# EAGLE design Desklamp V322 (EAGLE 6.4)
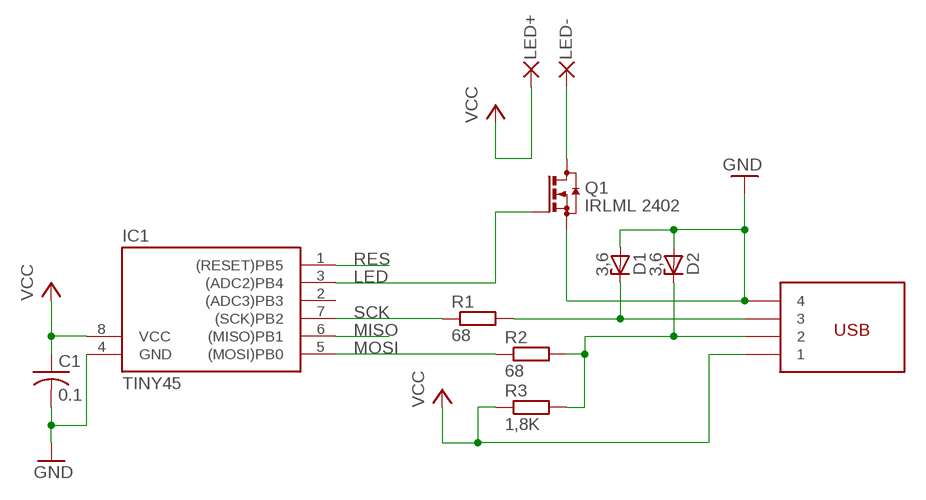
[diagram p0: schematic, sheet 1]

## Parts
C1  0.1  C-USC0805  [C0805]
D1  3,6  ZENER-DIODESOT23  [SOT23]
D2  3,6  ZENER-DIODESOT23  [SOT23]
IC1  TINY45  [SOIC8]
PAD7  LED+  SMD2  [SMD1,27-2,54]
PAD8  LED-  SMD2  [SMD1,27-2,54]
Q1  IRLML 2402  BSS123  [SOT23]
R1  68  R-EU_R0603  [R0603]
R2  68  R-EU_R0603  [R0603]
R3  1,8K  R-EU_R0603  [R0603]
U$1  USB_A_EDGE  [USB_A_EDGE]

## Nets
GND: C1.2 D1.1(A) D2.1(A) IC1.4(GND) Q1.2(S) U$1.P$3
LED: IC1.3((ADC2)PB4) Q1.1(G)
LED-: PAD8.1(P) Q1.3(D)
MISO: IC1.6((MISO)PB1)
MOSI: IC1.5((MOSI)PB0) R2.1
RES: IC1.1((RESET)PB5)
SCK: IC1.7((SCK)PB2) R1.1
USB2: D2.3(C) R2.2 R3.2 U$1.P$2
USB3: D1.3(C) R1.2 U$1.P$1
VCC: C1.1 IC1.8(VCC) PAD7.1(P) R3.1 U$1.P$4
Unconnected: IC1.2((ADC3)PB3)

## Library data of the parts
C1 = rcl:C-US: CAPACITOR, American symbol
D1 D2 = diode:ZENER-DIODE: Z-Diode
IC1 = avr-4:TINY45: ATTiny45 8-lead SOIC8
PAD7 PAD8 = wirepad:SMD2: SMD PAD
Q1 = transistor-small-signal:BSS123: N-CHANNEL MOS FET
R1-R3 = resistor:R-EU_: RESISTOR, European symbol
U$1 = macetech:USB_A_EDGE

## Board
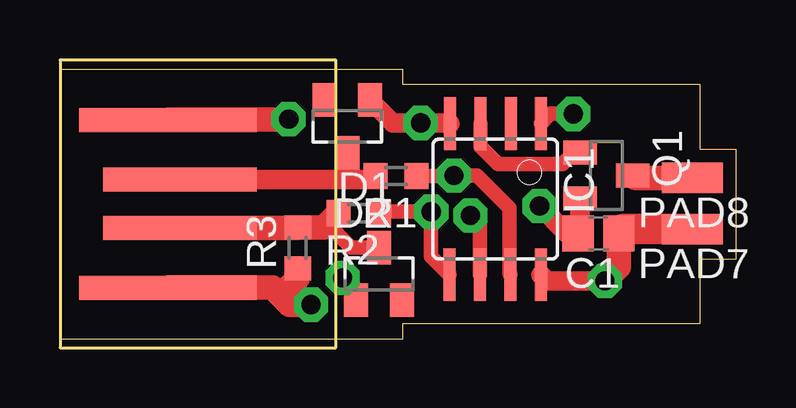
[diagram p1: board, top side]
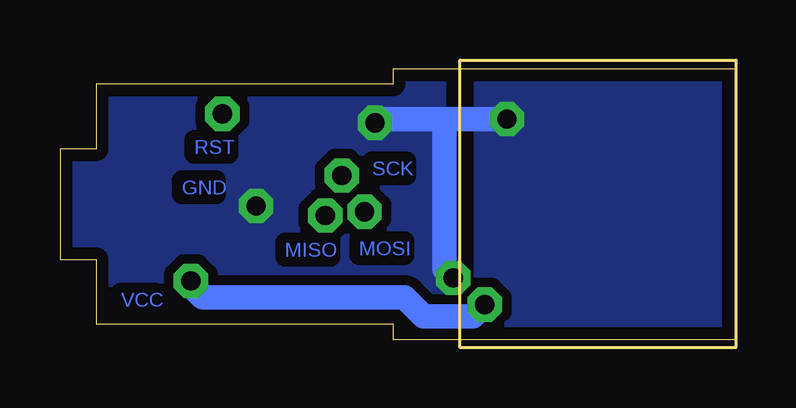
[diagram p2: board, bottom side, seen from below]

Size 28.18 x 11.27 mm. Coordinates in mm from the lower left corner, seen from the top.
Outline: 14.29,10.64 26.67,10.64 26.67,7.94 28.18,7.94 28.18,3.33 26.67,3.33 26.67,0.64 14.29,0.64 14.29,0 0,0 0,11.27 14.29,11.27 14.29,10.64
Copper layers (1*16): Top 0.035mm / dielectric 1.5mm / Bottom 0.035mm
Design rules "multi-cb_035um-cu *": minimum track width 6mil, minimum drill 12mil, track to track 6mil, track to pad 6mil, pad to pad 6mil, via to via 6mil, smd to smd 6mil, copper to edge 20mil, drill to drill 8mil, minimum pad ring 8mil, minimum via ring 6mil, stop-mask expansion 3mil, vias tented up to drill 0mil, thermal gap 8mil

### Footprints (pad centres in the part's own frame; a part is rotated, then mirrored left to right if it is on the bottom)
C0805 = smd 1.3 x 1.5: 1 -0.85,0; 2 0.85,0
SOT23 = smd 1 x 1.4: 1 -0.95,-1.1; 2 0.95,-1.1; 3 0,1.1
SOIC8 = smd 0.5 x 2.2: 1 -1.905,-3.154; 2 -0.645,-3.154; 3 0.625,-3.154; 4 1.895,-3.154; 5 1.905,3.154; 6 0.635,3.154; 7 -0.635,3.154; 8 -1.905,3.154
SMD1,27-2,54 = smd 1.27 x 2.54: 1 0,0
R0603 = smd 1 x 1.1: 1 -0.85,0; 2 0.85,0
USB_A_EDGE = smd 6.41 x 1: P$1 0,1; P$2 0,-1 | smd 7.41 x 1: P$3 -0.5,3.5; P$4 -0.5,-3.5

### Placement (x,y rotation side)
C1  22.45,4.41 180 top
D1  11.98,8.88 180 top
D2  13.3,2.72 0 top
IC1  18.15,5.84 180 top
PAD7  26.36,4.6 90 top
PAD8  26.36,6.72 90 top
Q1  22.78,6.83 270 top
R1  14.01,6.8 180 top
R2  12.46,5.26 180 top
R3  9.91,3.8 90 top
U$1  5,5.65 0 top

### Tracks (layer width: path | path; a pad name or v marks a point on that pad's centre or on a via)
GND  (via drill 0.8 pad 1.42)
  Top 0.813: IC1.4 16.23,9.02 v15.04,9.02 13.88,9.02 D1.1 | v11.78,2.56 12.35,1.99 D2.1 | Q1.2 21.68,4.49 C1.2 21.14,4.41 v20,5.56
  Top 1.016: v9.54,9.18 9.51,9.15 U$1.P$3
  Bottom 1.016: v15.04,9.02 14.88,9.18 v9.54,9.18 | v11.78,2.56 12.14,2.92 12.14,9.05
  pour Bottom (isolate 0.406): 0,11.27 28.18,11.27 28.18,0 0,0
LED
  Top 0.61: IC1.3 17.52,8.04 18.26,7.3 20.96,7.3 21.43,7.78 Q1.1
LED-
  Top 1.016: Q1.3 23.98,6.72 PAD8.1
MISO  (via drill 0.8 pad 1.42)
  Top 0.61: IC1.6 17.51,4.76 v17.11,5.16
MOSI  (via drill 0.8 pad 1.42)
  Top 0.61: 13.34,5.32 v15.48,5.32 15.48,3.46 IC1.5 | 13.34,5.32 13.26,5.32 | R2.1 13.31,5.29 13.34,5.32
RES  (via drill 0.8 pad 1.42)
  Top 0.61: IC1.1 20.46,9.4 v21.41,9.4
SCK  (via drill 0.8 pad 1.42)
  Top 0.61: IC1.7 18.73,2.74 18.73,5.48 17.38,6.83 v16.43,6.83 | R1.1 16.41,6.8
  Top 0.813: 16.41,6.8 v16.43,6.83
USB2
  Top 0.61: D2.3 12.13,3.82 11.15,4.8
  Top 1.016: U$1.P$2 R3.2 11.01,4.65 11.15,4.8 R2.2
USB3
  Top 0.813: U$1.P$1 11.99,6.65 | 11.99,6.65 13,6.65 R1.2 | D1.3 11.98,6.66 11.99,6.65
VCC  (via drill 0.8 pad 1.42)
  Top 0.813: IC1.8 20.31,2.43 v22.72,2.43
  Top 1.016: U$1.P$4 8.87,2.15 9.2,1.82 | v10.47,1.44 9.58,1.44 9.2,1.82 | C1.1 23.3,3.01 v22.72,2.43 | R3.1 9.91,2.53 9.2,1.82
  Top 1.27: C1.1 23.49,4.6 PAD7.1
  Bottom 1.016: v10.47,1.44 10.96,0.95 13.02,0.95 13.81,1.75 22.23,1.75 22.72,2.24 v22.72,2.43

### Text on the board
Bottom: RST | SCK | GND | MOSI | MISO | VCC